# Altium project project_1.prjpcb
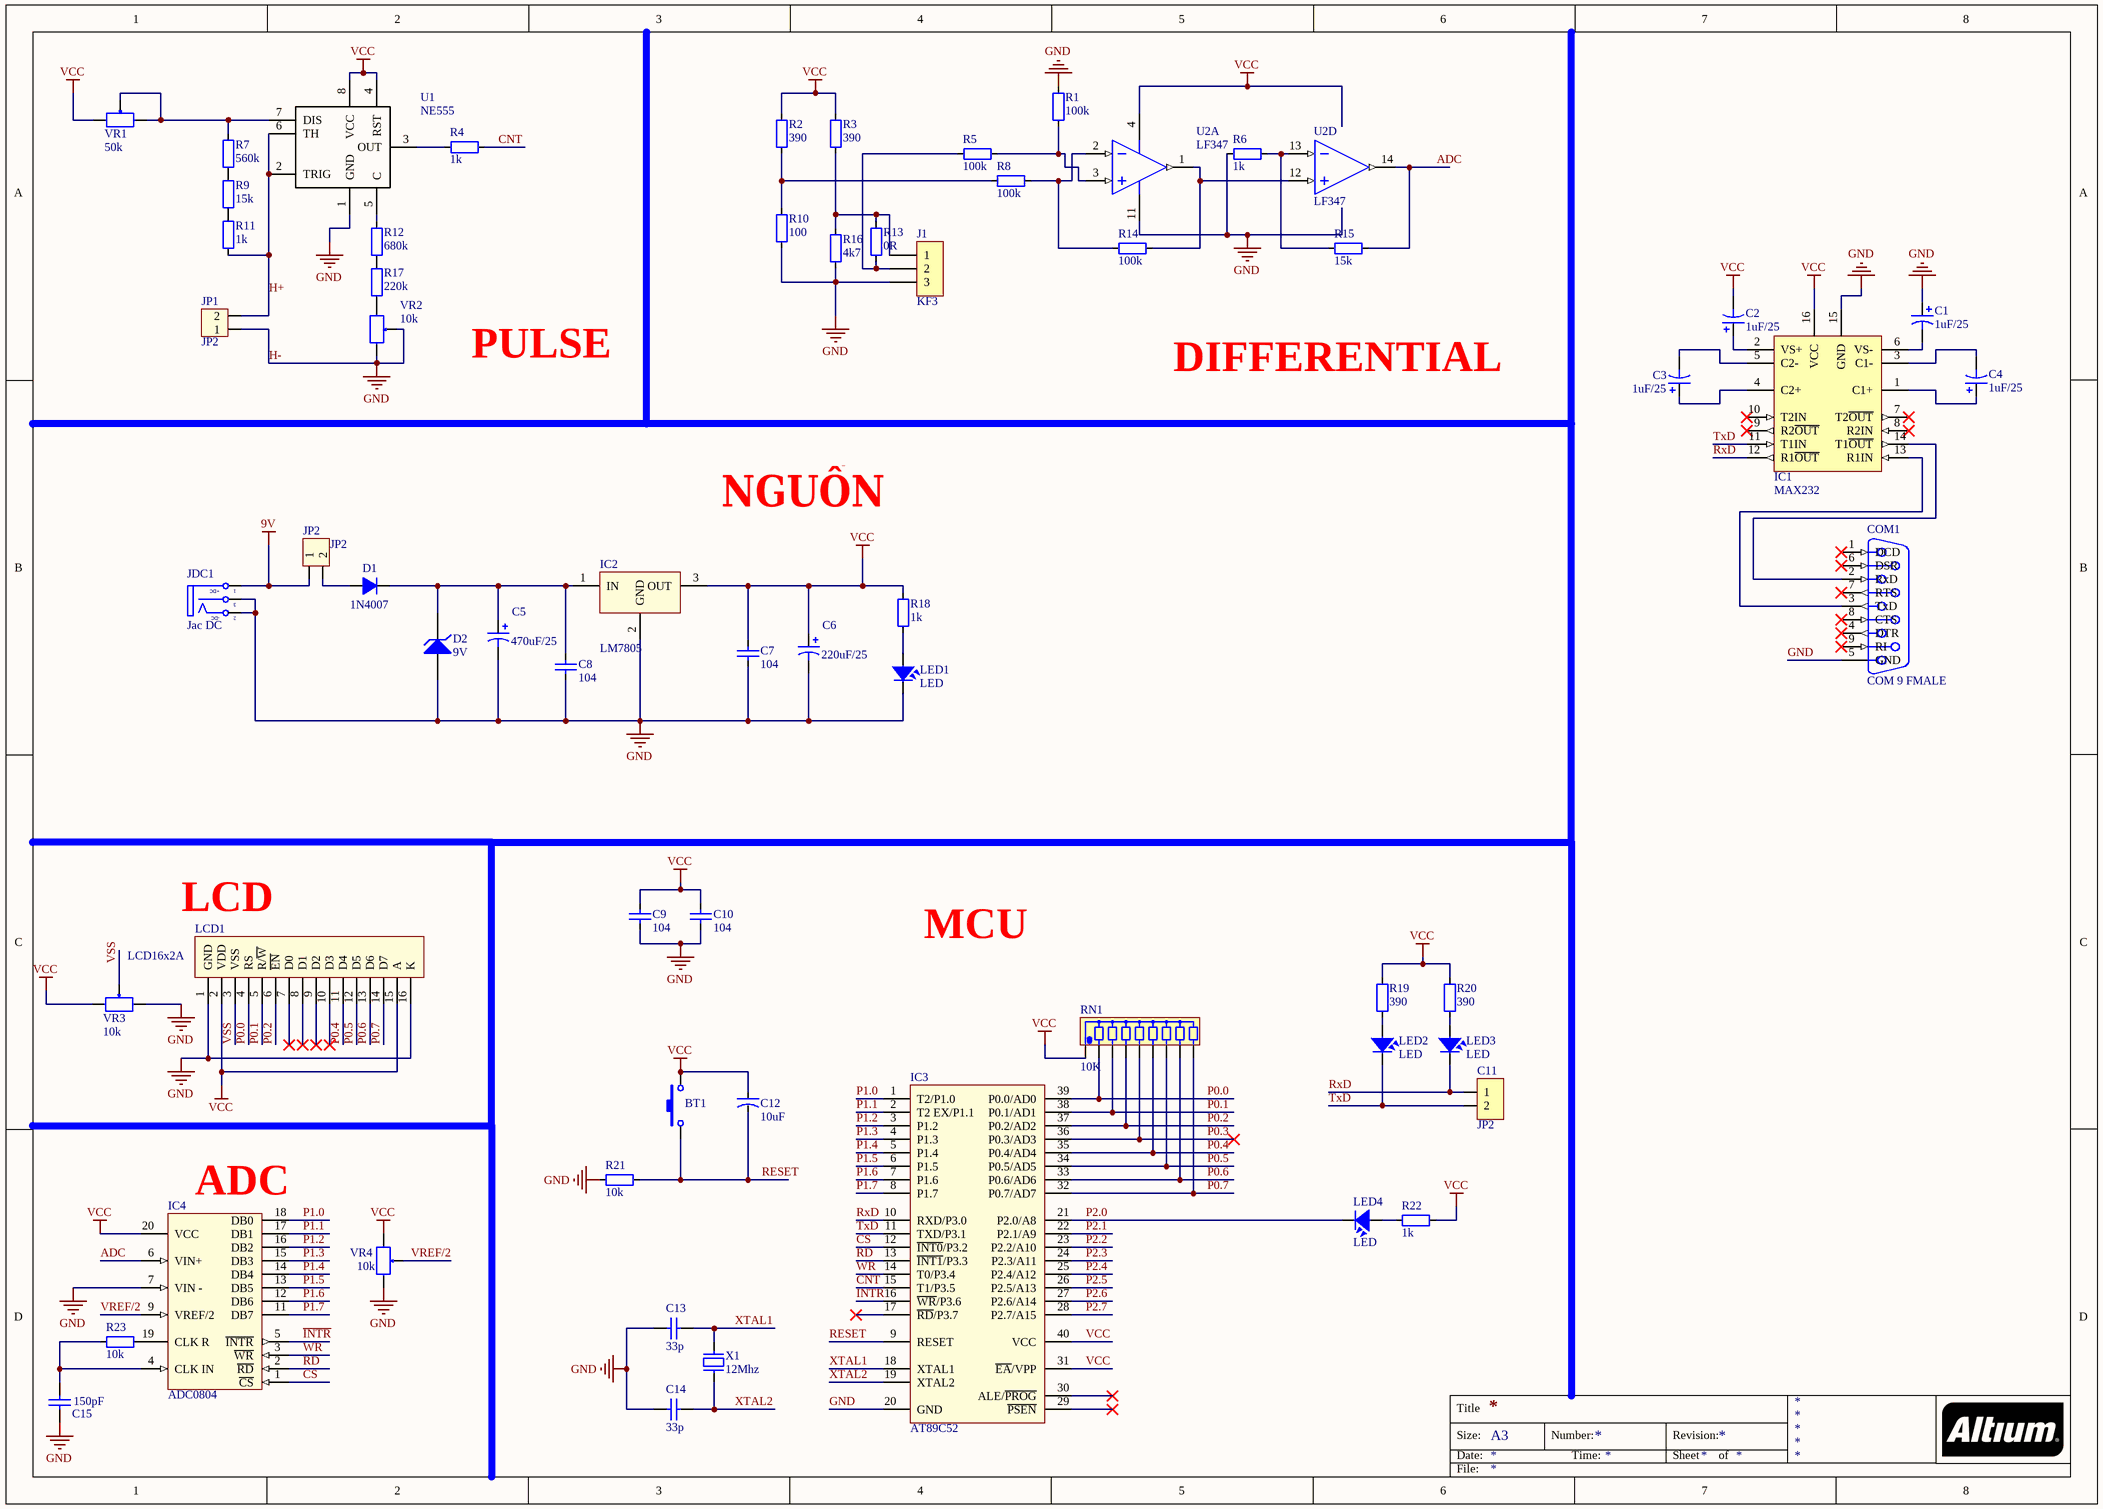
[diagram p0: schematic.schdoc]
1 sheet, 63 parts. Net scope: global (net labels, ports and power ports of the same name join across sheets).
Board file: pcb.PcbDoc

## Sheet schematic.schdoc
size A3

### Parts
BT1  Nút Nhấn 2 Chân 3x6x2.5MM SMD  [Nut Nhan 2 Chan SMD_N]  (value not drawn)
C1  1uF/25  [C8mm]
C2  1uF/25  [C8mm]
C3  1uF/25  [C8mm]
C4  1uF/25  [C8mm]
C5  470uF/25  [C8mm]
C6  220uF/25  [C8mm]
C7  104  [CAP_0805]
C8  104  [CAP_0805]
C9  104  [CAP_0805]
C10  104  [CAP_0805]
C11  JP2  [JP2-C1T]
C12  10uF  [CAP-ALU-SMD-C]
C13  value 33p  [CAP_CERAMIC]  (hidden comment: Capacitor Ceramic)
C14  value 33p  [CAP_CERAMIC]  (hidden comment: Capacitor Ceramic)
C15  150pF  [CAP_0805]
COM1  COM 9 FMALE  [COM9B]
D1  1N4007  [D1A]
D2  9V  [DIODE_ZENER_SMD]
IC1  MAX232  [DIP16/W0.3]
IC2  LM7805  [QTO-220H3]
IC3  AT89C52  [DIP40/W0.6]
IC4  ADC0804  [DIP20/W0.3]
J1  KF3  [KF3-5.08]
JDC1  Jac DC  [DC-IN]
JP1  JP2  [CON2]
JP2  JP2  [CON2]
LCD1  LCD16x2A  [SAMTEC-SSQ-116-01-X-S]
LED1  LED  [LED-0805-Red]
LED2  LED  [LED-0805-Blue]
LED3  LED  [LED-0805-Green]
LED4  LED  [LED-0805-Yellow]
R1  100k  [RES-SMD-0805]
R2  390  [RES-SMD-0805]
R3  390  [RES-SMD-0805]
R4  1k  [RES-SMD-0805]
R5  100k  [RES-SMD-0805]
R6  1k  [RES-SMD-0805]
R7  560k  [RES-SMD-0805]
R8  100k  [RES-SMD-0805]
R9  15k  [RES-SMD-0805]
R10  100  [RES-SMD-0805]
R11  1k  [RES-SMD-0805]
R12  680k  [RES-SMD-0805]
R13  0R  [RES-SMD-0805]
R14  100k  [RES-SMD-0805]
R15  15k  [RES-SMD-0805]
R16  4k7  [RES-SMD-0805]
R17  220k  [RES-SMD-0805]
R18  1k  [RES-SMD-0805]
R19  390  [RES-SMD-0805]
R20  390  [RES-SMD-0805]
R21  10k  [RES-SMD-0805]
R22  1k  [RES-SMD-0805]
R23  10k  [RES-SMD-0805]
RN1  10K  [RN8]
U1  NE555  [DIP8]
U2  LF347  [DIP14/W0.3]  (parts A,D of 4)
VR1  50k  [VAR_RESISTOR]
VR2  10k  [VAR_RESISTOR]
VR3  10k  [VR_3362P]
VR4  10k  [VAR_RESISTOR]
X1  12Mhz  [XT2]

### Nets
9V: JDC1.1(T) JP2.1
GND: C1.1 C5.2 C6.2 C7.1 C8.1 C9.1 C10.1 C13.1 C14.1 C15.1 COM1.5(GND) D2.1(A) IC1.15(GND) IC2.2(GND) IC3.20(GND) IC4.7(VIN_-) IC4.8(AGND) IC4.10(DGND) J1.3 JDC1.2(TN) JDC1.3(S) JP1.1 LCD1.1(GND) LCD1.16(K) LED1.2 R1.1 R6.1 R10.1 R16.1 R21.2 U1.1(GND) U2.11(VEE) VR2.2 VR2.3 VR3.3 VR4.3  [also labelled H-]
VCC: BT1.2 C2.2 C6.1 C7.2 C9.2 C10.2 C12.1 IC1.16(VCC) IC2.3(OUT) IC3.31(~{EA}/VPP) IC3.40(VCC) IC4.20(VCC) LCD1.2(VDD) LCD1.15(A) R2.1 R3.2 R18.2 R19.2 R20.2 R22.2 RN1.1 U1.4(RST) U1.8(VCC) U2.4(VCC) VR1.1 VR3.1 VR4.1
ADC: IC4.6(VIN+) R15.2 U2.14(4_OUT)
~{CS}: IC3.12(~{INT0}/P3.2) IC4.1(~{CS})
CNT: IC3.15(T1/P3.5) R4.2
H+: JP1.2 R11.1 U1.2(TRIG) U1.6(TH)
~{INTR}: IC3.16(~{WR}/P3.6) IC4.5(~{INTR})
P0.0: IC3.39(P0.0/AD0) LCD1.4(RS) RN1.2
P0.1: IC3.38(P0.1/AD1) LCD1.5(R/~{W}) RN1.3
P0.2: IC3.37(P0.2/AD2) LCD1.6(~{EN}) RN1.4
P0.3: IC3.36(P0.3/AD3) RN1.5
P0.4: IC3.35(P0.4/AD4) LCD1.11(D4) RN1.6
P0.5: IC3.34(P0.5/AD5) LCD1.12(D5) RN1.7
P0.6: IC3.33(P0.6/AD6) LCD1.13(D6) RN1.8
P0.7: IC3.32(P0.7/AD7) LCD1.14(D7) RN1.9
P1.0: IC3.1(T2/P1.0) IC4.18(DB0)
P1.1: IC3.2(T2_EX/P1.1) IC4.17(DB1)
P1.2: IC3.3(P1.2) IC4.16(DB2)
P1.3: IC3.4(P1.3) IC4.15(DB3)
P1.4: IC3.5(P1.4) IC4.14(DB4)
P1.5: IC3.6(P1.5) IC4.13(DB5)
P1.6: IC3.7(P1.6) IC4.12(DB6)
P1.7: IC3.8(P1.7) IC4.11(DB7)
P2.0: IC3.21(P2.0/A8) LED4.2
P2.1: IC3.22(P2.1/A9)
P2.2: IC3.23(P2.2/A10)
P2.3: IC3.24(P2.3/A11)
P2.4: IC3.25(P2.4/A12)
P2.5: IC3.26(P2.5/A13)
P2.6: IC3.27(P2.6/A14)
P2.7: IC3.28(P2.7/A15)
~{RD}: IC3.13(~{INT1}/P3.3) IC4.2(~{RD})
RESET: BT1.1 C12.2 IC3.9(RESET) R21.1
RxD: C11.1 IC1.12(R1~{OUT}) IC3.10(RXD/P3.0) LED3.2
TxD: C11.2 IC1.11(T1IN) IC3.11(TXD/P3.1) LED2.2
VREF/2: IC4.9(VREF/2) VR4.2
VSS: LCD1.3(VSS) VR3.2
~{WR}: IC3.14(T0/P3.4) IC4.3(~{WR})
XTAL1: C13.2 IC3.18(XTAL1) X1.1
XTAL2: C14.2 IC3.19(XTAL2) X1.2
NetC1_2: C1.2 IC1.6(VS-)
NetC2_1: C2.1 IC1.2(VS+)
NetC3_1: C3.1 IC1.4(C2+)
NetC3_2: C3.2 IC1.5(C2-)
NetC4_1: C4.1 IC1.1(C1+)
NetC4_2: C4.2 IC1.3(C1-)
NetC5_1: C5.1 C8.2 D1.2(K) D2.2(K) IC2.1(IN)
NetC15_2: C15.2 IC4.4(CLK_IN) R23.1
NetCOM1_2: COM1.2(RxD) IC1.14(T1~{OUT})
NetCOM1_3: COM1.3(TxD) IC1.13(R1IN)
NetD1_1: D1.1(A) JP2.2
NetIC4_19: IC4.19(CLK_R) R23.2
NetJ1_1: J1.1 R3.1 R13.2 R16.2
NetJ1_2: J1.2 R5.1 R13.1
NetLED1_1: LED1.1 R18.1
NetLED2_1: LED2.1 R19.1
NetLED3_1: LED3.1 R20.1
NetLED4_1: LED4.1 R22.1
NetR1_2: R1.2 R5.2 U2.3(1_IN+)
NetR2_2: R2.2 R8.1 R10.2
NetR4_1: R4.1 U1.3(OUT)
NetR6_2: R6.2 R15.1 U2.13(4_IN-)
NetR7_1: R7.1 R9.2
NetR7_2: R7.2 U1.7(DIS) VR1.2 VR1.3
NetR8_2: R8.2 R14.1 U2.2(1_IN-)
NetR9_1: R9.1 R11.2
NetR12_1: R12.1 R17.2
NetR12_2: R12.2 U1.5(C)
NetR14_2: R14.2 U2.1(1_OUT) U2.12(4_IN+)
NetR17_1: R17.1 VR2.1

Not connected (* = marked no-connect by the designer): COM1 1(DCD)* 4(DTR)* 6(DSR)* 7(RTS)* 8(CTS)* 9(RI)* 10(MH1) 11(MH2); IC1 7(T2~{OUT})* 8(R2IN)* 9(R2~{OUT})* 10(T2IN)*; IC3 17(~{RD}/P3.7)* 29(~{PSEN})* 30(ALE/~{PROG})*; LCD1 7(D0)* 8(D1)* 9(D2)* 10(D3)*

### Notes on the sheet
- PULSE
- DIFFERENTIAL
- NGUỒN
- LCD
- MCU
- (near IC4) ADC
- Title
- Size:
- Date:
- A3
- Number:
- Time:
- Revision:
- Sheet
- of
- File:
- (in symbol DCIN) +DC; -DC

### Library data of the parts
BT1 = Nut Nhan 2 Chan SMD: Dán; Don_Vi: Con; Ma_Hang: MH001036; Ghi_Chu: *; Kieu_Chan: *; Ten_Linh_Kien: Nút Nhấn 2 Chân 3x6x2.5MM SMD; Chung_Loai: Dán
C1-C6 = Cap Pol: Polarized Capacitor (Axial); Published: 8-Jun-2000; LatestRevisionDate: 17-Jul-2002; LatestRevisionNote: Re-released for DXP Platform.; PackageReference: POLAR0.8; Publisher: Altium Limited
C7-C10 C15 = CapSMD: Capacitor; Value: 33p; Published: 8-Jun-2000; LatestRevisionDate: 17-Jul-2002; LatestRevisionNote: Re-released for DXP Platform.; PackageReference: RAD-0.3; Publisher: Altium Limited
C11 = JP2: WR-PHD 2.54 mm Angled Socket Header; Manufacturer: W¨¹rth Elektronik eiSos GmbH; partNo: 613002143121; ComponentLink1 Description: Manufacturer; ComponentLink2 Description: Datasheet; NoPins: 02; Created Date: 29 March 2013; ComponentLink1URL: http://www.we-online.com; ComponentLink2URL: http://katalog.we-online.de/em/datasheet/6130xx143121.pdf; Created by: Karrer Zheng
C12 = CAP-ALU-SMD: Polarized Capacitor (Axial); Published: 8-Jun-2000; LatestRevisionDate: 17-Jul-2002; LatestRevisionNote: Re-released for DXP Platform.; PackageReference: POLAR0.8; Publisher: Altium Limited
C13 C14 = CapCeramic: Capacitor; Published: 8-Jun-2000; LatestRevisionDate: 17-Jul-2002; LatestRevisionNote: Re-released for DXP Platform.; PackageReference: RAD-0.3; Publisher: Altium Limited
COM1 = COM9F: COM 9; PackageDocument: O; Positions: 9; Gender: Receptacle; Value: COM 9; Published: 15-Jun-2001; LatestRevisionDate: 17-Jul-2002; LatestRevisionNote: Re-released for DXP Platform.; DatasheetDocument: 1-Sep-1999; PackageReference: 788750; Publisher: Altium Limited; Orientation: Right Angle
D1 = D1A: Diode 1A; Value: 1N4007
D2 = Diode Zener: Zener Diode; Published: 8-Jun-2000; LatestRevisionDate: 17-Jul-2002; LatestRevisionNote: Re-released for DXP Platform.; PackageReference: DIODE-0.7; Publisher: Altium Limited
IC1 = MAX232: Dual EIA-232 Driver/Receiver; Value: MAX232
IC2 = LM78xx: On ap +, from + 5 to + 24VDC; Value: LM7805
IC3 = AT89C52: Atmel AT89C52, 8k Byte Flash Memory , 40 Pin; Value: AT89C52
IC4 = ADC0804: 8-Bit A/D Converter (01-05); Value: ADC0804
J1 = KF3: Manufacturer: Würth Elektronik eiSos GmbH; partNo: 691103110003; ComponentLink1 Description: Manufacturer; ComponentLink2 Description: Datasheet; NoPins: 3; Created Date: 29 October 2013; ComponentLink1URL: http://www.we-online.com; ComponentLink2URL: http://katalog.we-online.de/em/datasheet/6911031100xx.pdf; Created by: Karrer Zheng
JDC1 = DCIN: Jac DC input; Value: Jac DC
JP1 JP2 = Con2: Connector 2; Value: Connector 2
LCD1 = LCD16x2: LCD dipslay 16 char, 2 line; Value: LCD16x2A
LED1-LED4 = LED: LED Single colour Green and Red; Value: LED 3 ly Single Colour
R1-R23 = Resistor - SMD: Resistor; Manufacturer: Generic Components; Class: Passive; Published: 08/06/2000; Publisher: Altium Hobart Technology Centre
RN1 = RN8: Resistor 8 (Thanh); Value: Tro thanh 10K
U1 = NE555: TIMER IC; Manufacturer Part Number: NE555DT; Manufacturer: STMicroelectronics; Frequency: 500kHz; Voltage - Supply: 4.5 V ~ 16 V; Current: 200mA; Supplier 1: Digi-Key; Supplier Part Number 1: 497-1962-2-ND; Supplier: Digi-Key; Category: Integrated Circuits (ICs); Supplier Part Number: 497-1962-2-ND; Package / Case: 8-SOIC (3.9mm Width); Packaging: Tape & Reel (TR); RoHS: RoHS Compliant; Operating Temperature: 0°C ~ 70°C; Count: -; Type: 555 Type, Timer/Oscillator (Single)
U2 = LF347: Low Power Quad Operational Amplifier; Manufacturer Part Number: LF347BD; Manufacturer: Texas Instruments; Text Field1: pristel=Nsc\nsanopea\<parttype>.ckt; Slew Rate: 13 V/µs; Voltage - Supply, Single/Dual (±): 7 V ~ 36 V, ±3.5 V ~ 18 V; Current - Input Bias: 50pA; Voltage - Input Offset: 3000µV; Number of Circuits: 4; Gain Bandwidth Product: 3MHz; Amplifier Type: J-FET; Current - Supply: 8mA; Supplier 1: Digi-Key; Supplier Part Number 1: 296-7136-5-ND; Package / Case: 14-SOIC (3.9mm Width), 14-SOL; Supplier: Digi-Key; Current - Output / Channel: -; Packaging: Tube; RoHS: RoHS Compliant; Output Type: -; Operating Temperature: 0°C ~ 70°C; Category: Integrated Circuits (ICs); Supplier Part Number: 296-7136-5-ND
VR1-VR4 = VR: Var Resistor; Value: VR 10K
X1 = XT2: Crystal For all Crystal 2pin.; Value: 4Mhz